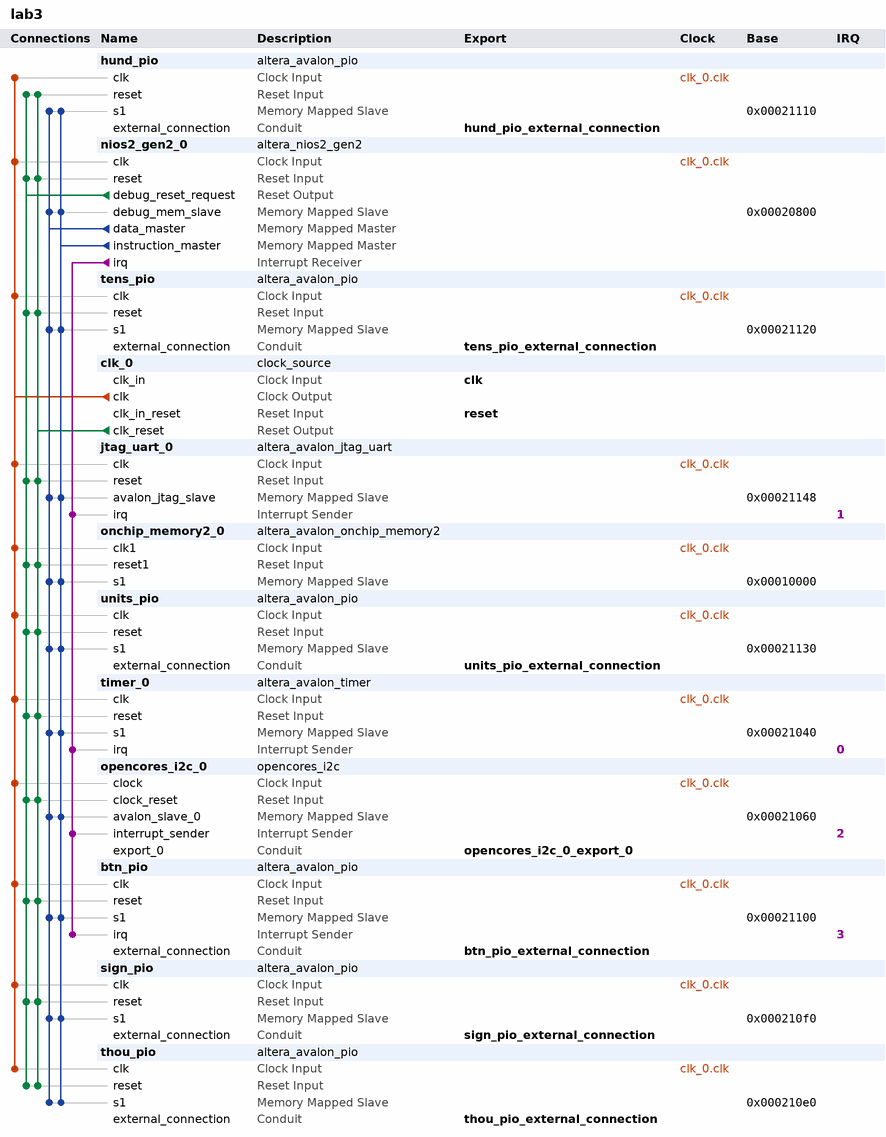
[diagram p0: system contents]
# Platform Designer (Qsys) system lab3, MAX 10 10M50DAF484C7G
# Parameters at their usual value, and those the tool derives, are not listed.
package require -exact qsys 18.1
create_system lab3
set_project_property DEVICE_FAMILY {MAX 10}
set_project_property DEVICE 10M50DAF484C7G

add_instance hund_pio altera_avalon_pio 18.1
set_instance_parameter_value hund_pio direction Output
set_instance_parameter_value hund_pio width 4

add_instance nios2_gen2_0 altera_nios2_gen2 18.1
set_instance_parameter_value nios2_gen2_0 dcache_size 2048
set_instance_parameter_value nios2_gen2_0 exceptionSlave onchip_memory2_0.s1
set_instance_parameter_value nios2_gen2_0 icache_size 4096
set_instance_parameter_value nios2_gen2_0 impl Tiny
set_instance_parameter_value nios2_gen2_0 resetSlave onchip_memory2_0.s1

add_instance tens_pio altera_avalon_pio 18.1
set_instance_parameter_value tens_pio direction Output
set_instance_parameter_value tens_pio width 4

add_instance clk_0 clock_source 18.1
set_instance_parameter_value clk_0 clockFrequency 50000000

add_instance jtag_uart_0 altera_avalon_jtag_uart 18.1
set_instance_parameter_value jtag_uart_0 simInteractiveOptions NO_INTERACTIVE_WINDOWS

add_instance onchip_memory2_0 altera_avalon_onchip_memory2 18.1
set_instance_parameter_value onchip_memory2_0 dataWidth 32
set_instance_parameter_value onchip_memory2_0 dualPort false
set_instance_parameter_value onchip_memory2_0 initMemContent false
set_instance_parameter_value onchip_memory2_0 initializationFileName onchip_mem.hex
set_instance_parameter_value onchip_memory2_0 memorySize 65536

add_instance units_pio altera_avalon_pio 18.1
set_instance_parameter_value units_pio direction Output
set_instance_parameter_value units_pio width 4

add_instance timer_0 altera_avalon_timer 18.1
set_instance_parameter_value timer_0 period 1
set_instance_parameter_value timer_0 periodUnits SEC

add_instance opencores_i2c_0 opencores_i2c 9.1

add_instance btn_pio altera_avalon_pio 18.1
set_instance_parameter_value btn_pio direction Input
set_instance_parameter_value btn_pio generateIRQ true
set_instance_parameter_value btn_pio width 1

add_instance sign_pio altera_avalon_pio 18.1
set_instance_parameter_value sign_pio direction Output
set_instance_parameter_value sign_pio width 4

add_instance thou_pio altera_avalon_pio 18.1
set_instance_parameter_value thou_pio direction Output
set_instance_parameter_value thou_pio width 4

# connections
add_connection clk_0.clk btn_pio.clk clock
add_connection clk_0.clk hund_pio.clk clock
add_connection clk_0.clk jtag_uart_0.clk clock
add_connection clk_0.clk nios2_gen2_0.clk clock
add_connection clk_0.clk onchip_memory2_0.clk1 clock
add_connection clk_0.clk opencores_i2c_0.clock clock
add_connection clk_0.clk sign_pio.clk clock
add_connection clk_0.clk tens_pio.clk clock
add_connection clk_0.clk thou_pio.clk clock
add_connection clk_0.clk timer_0.clk clock
add_connection clk_0.clk units_pio.clk clock
add_connection clk_0.clk_reset btn_pio.reset reset
add_connection clk_0.clk_reset hund_pio.reset reset
add_connection clk_0.clk_reset jtag_uart_0.reset reset
add_connection clk_0.clk_reset nios2_gen2_0.reset reset
add_connection clk_0.clk_reset onchip_memory2_0.reset1 reset
add_connection clk_0.clk_reset opencores_i2c_0.clock_reset reset
add_connection clk_0.clk_reset sign_pio.reset reset
add_connection clk_0.clk_reset tens_pio.reset reset
add_connection clk_0.clk_reset thou_pio.reset reset
add_connection clk_0.clk_reset timer_0.reset reset
add_connection clk_0.clk_reset units_pio.reset reset
add_connection nios2_gen2_0.debug_reset_request btn_pio.reset reset
add_connection nios2_gen2_0.debug_reset_request hund_pio.reset reset
add_connection nios2_gen2_0.debug_reset_request jtag_uart_0.reset reset
add_connection nios2_gen2_0.debug_reset_request nios2_gen2_0.reset reset
add_connection nios2_gen2_0.debug_reset_request onchip_memory2_0.reset1 reset
add_connection nios2_gen2_0.debug_reset_request opencores_i2c_0.clock_reset reset
add_connection nios2_gen2_0.debug_reset_request sign_pio.reset reset
add_connection nios2_gen2_0.debug_reset_request tens_pio.reset reset
add_connection nios2_gen2_0.debug_reset_request thou_pio.reset reset
add_connection nios2_gen2_0.debug_reset_request timer_0.reset reset
add_connection nios2_gen2_0.debug_reset_request units_pio.reset reset
add_connection nios2_gen2_0.data_master btn_pio.s1 avalon
set_connection_parameter_value nios2_gen2_0.data_master/btn_pio.s1 baseAddress 0x00021100
add_connection nios2_gen2_0.data_master hund_pio.s1 avalon
set_connection_parameter_value nios2_gen2_0.data_master/hund_pio.s1 baseAddress 0x00021110
add_connection nios2_gen2_0.data_master jtag_uart_0.avalon_jtag_slave avalon
set_connection_parameter_value nios2_gen2_0.data_master/jtag_uart_0.avalon_jtag_slave baseAddress 0x00021148
add_connection nios2_gen2_0.data_master nios2_gen2_0.debug_mem_slave avalon
set_connection_parameter_value nios2_gen2_0.data_master/nios2_gen2_0.debug_mem_slave baseAddress 0x00020800
add_connection nios2_gen2_0.data_master onchip_memory2_0.s1 avalon
set_connection_parameter_value nios2_gen2_0.data_master/onchip_memory2_0.s1 baseAddress 0x00010000
add_connection nios2_gen2_0.data_master opencores_i2c_0.avalon_slave_0 avalon
set_connection_parameter_value nios2_gen2_0.data_master/opencores_i2c_0.avalon_slave_0 baseAddress 0x00021060
add_connection nios2_gen2_0.data_master sign_pio.s1 avalon
set_connection_parameter_value nios2_gen2_0.data_master/sign_pio.s1 baseAddress 0x000210f0
add_connection nios2_gen2_0.data_master tens_pio.s1 avalon
set_connection_parameter_value nios2_gen2_0.data_master/tens_pio.s1 baseAddress 0x00021120
add_connection nios2_gen2_0.data_master thou_pio.s1 avalon
set_connection_parameter_value nios2_gen2_0.data_master/thou_pio.s1 baseAddress 0x000210e0
add_connection nios2_gen2_0.data_master timer_0.s1 avalon
set_connection_parameter_value nios2_gen2_0.data_master/timer_0.s1 baseAddress 0x00021040
add_connection nios2_gen2_0.data_master units_pio.s1 avalon
set_connection_parameter_value nios2_gen2_0.data_master/units_pio.s1 baseAddress 0x00021130
add_connection nios2_gen2_0.instruction_master btn_pio.s1 avalon
set_connection_parameter_value nios2_gen2_0.instruction_master/btn_pio.s1 baseAddress 0x00021100
add_connection nios2_gen2_0.instruction_master hund_pio.s1 avalon
set_connection_parameter_value nios2_gen2_0.instruction_master/hund_pio.s1 baseAddress 0x00021110
add_connection nios2_gen2_0.instruction_master jtag_uart_0.avalon_jtag_slave avalon
set_connection_parameter_value nios2_gen2_0.instruction_master/jtag_uart_0.avalon_jtag_slave baseAddress 0x00021148
add_connection nios2_gen2_0.instruction_master nios2_gen2_0.debug_mem_slave avalon
set_connection_parameter_value nios2_gen2_0.instruction_master/nios2_gen2_0.debug_mem_slave baseAddress 0x00020800
add_connection nios2_gen2_0.instruction_master onchip_memory2_0.s1 avalon
set_connection_parameter_value nios2_gen2_0.instruction_master/onchip_memory2_0.s1 baseAddress 0x00010000
add_connection nios2_gen2_0.instruction_master opencores_i2c_0.avalon_slave_0 avalon
set_connection_parameter_value nios2_gen2_0.instruction_master/opencores_i2c_0.avalon_slave_0 baseAddress 0x00021060
add_connection nios2_gen2_0.instruction_master sign_pio.s1 avalon
set_connection_parameter_value nios2_gen2_0.instruction_master/sign_pio.s1 baseAddress 0x000210f0
add_connection nios2_gen2_0.instruction_master tens_pio.s1 avalon
set_connection_parameter_value nios2_gen2_0.instruction_master/tens_pio.s1 baseAddress 0x00021120
add_connection nios2_gen2_0.instruction_master thou_pio.s1 avalon
set_connection_parameter_value nios2_gen2_0.instruction_master/thou_pio.s1 baseAddress 0x000210e0
add_connection nios2_gen2_0.instruction_master timer_0.s1 avalon
set_connection_parameter_value nios2_gen2_0.instruction_master/timer_0.s1 baseAddress 0x00021040
add_connection nios2_gen2_0.instruction_master units_pio.s1 avalon
set_connection_parameter_value nios2_gen2_0.instruction_master/units_pio.s1 baseAddress 0x00021130
add_connection nios2_gen2_0.irq btn_pio.irq interrupt
set_connection_parameter_value nios2_gen2_0.irq/btn_pio.irq irqNumber 3
add_connection nios2_gen2_0.irq jtag_uart_0.irq interrupt
set_connection_parameter_value nios2_gen2_0.irq/jtag_uart_0.irq irqNumber 1
add_connection nios2_gen2_0.irq opencores_i2c_0.interrupt_sender interrupt
set_connection_parameter_value nios2_gen2_0.irq/opencores_i2c_0.interrupt_sender irqNumber 2
add_connection nios2_gen2_0.irq timer_0.irq interrupt
set_connection_parameter_value nios2_gen2_0.irq/timer_0.irq irqNumber 0

# exported interfaces
add_interface btn_pio_external_connection conduit end
set_interface_property btn_pio_external_connection EXPORT_OF btn_pio.external_connection
add_interface clk clock sink
set_interface_property clk EXPORT_OF clk_0.clk_in
add_interface hund_pio_external_connection conduit end
set_interface_property hund_pio_external_connection EXPORT_OF hund_pio.external_connection
add_interface opencores_i2c_0_export_0 conduit end
set_interface_property opencores_i2c_0_export_0 EXPORT_OF opencores_i2c_0.export_0
add_interface reset reset sink
set_interface_property reset EXPORT_OF clk_0.clk_in_reset
add_interface sign_pio_external_connection conduit end
set_interface_property sign_pio_external_connection EXPORT_OF sign_pio.external_connection
add_interface tens_pio_external_connection conduit end
set_interface_property tens_pio_external_connection EXPORT_OF tens_pio.external_connection
add_interface thou_pio_external_connection conduit end
set_interface_property thou_pio_external_connection EXPORT_OF thou_pio.external_connection
add_interface units_pio_external_connection conduit end
set_interface_property units_pio_external_connection EXPORT_OF units_pio.external_connection

set_interconnect_requirement {$system} qsys_mm.clockCrossingAdapter HANDSHAKE
set_interconnect_requirement {$system} qsys_mm.enableEccProtection FALSE
set_interconnect_requirement {$system} qsys_mm.insertDefaultSlave FALSE
set_interconnect_requirement {$system} qsys_mm.maxAdditionalLatency 1

save_system lab3.qsys
